# Altium schematic sheet 00 BLOCK DIAGRAM.SchDoc
size A3
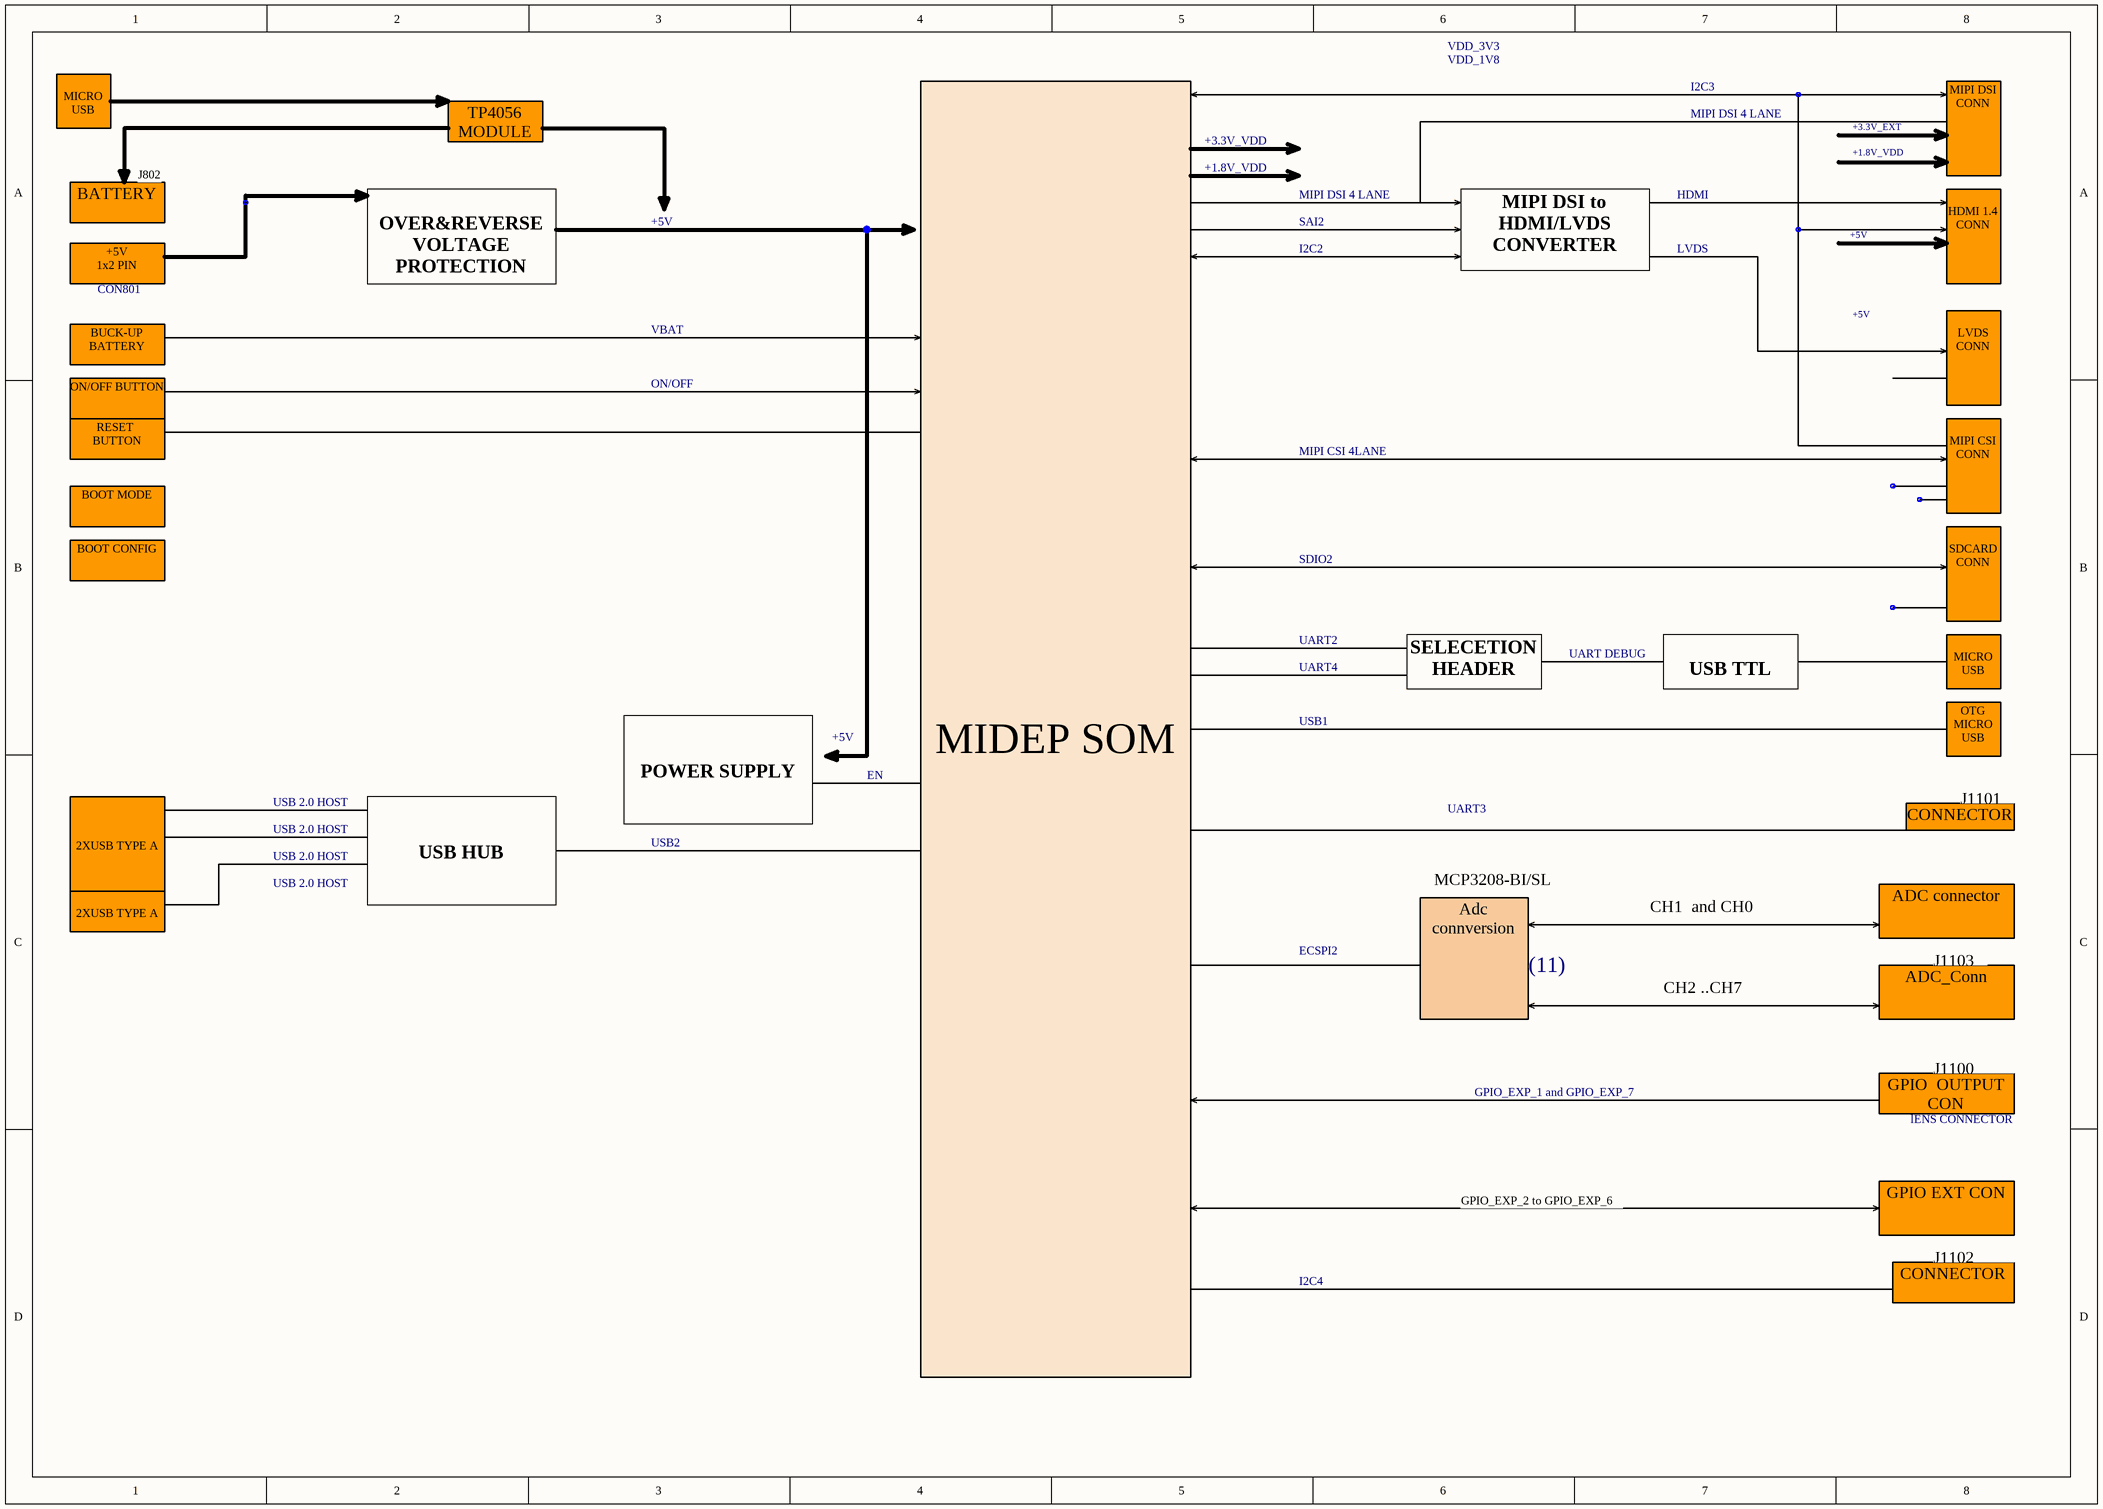
[diagram p0: 00 BLOCK DIAGRAM.SchDoc]

## Notes on the sheet
- VDD_3V3
- VDD_1V8
- I2C3
- MICRO USB
- J802
- TP4056
  MODULE
- +3.3V_VDD
- +1.8V_VDD
- MIPI DSI 4 LANE
- +3.3V_EXT
- MIPI DSI CONN
- BATTERY
- +5V
- SAI2
- HDMI
- +5V
  1x2 PIN
- CON801
- OVER&REVERSE VOLTAGE
  PROTECTION
- I2C2
- MIPI DSI to HDMI/LVDS CONVERTER
- LVDS
- HDMI 1.4 CONN
- BUCK-UP BATTERY
- VBAT
- ON/OFF BUTTON
- ON/OFF
- LVDS CONN
- RESET
  BUTTON
- MIPI CSI 4LANE
- MIPI CSI CONN
- BOOT MODE
- BOOT CONFIG
- SDIO2
- UART2
- SDCARD CONN
- UART4
- SELECETION HEADER
- UART DEBUG
- USB TTL
- EN
- USB1
- OTG
  MICRO USB
- USB 2.0 HOST
- POWER SUPPLY
- USB2
- UART3
- CONNECTOR
- J1101
- 2XUSB TYPE A
- USB HUB
- MCP3208-BI/SL
- CH1  and CH0
- ECSPI2
- (11)
- CH2 ..CH7
- ADC connector
- J1103
- Adc connversion
- ADC_Conn
- GPIO_EXP_1 and GPIO_EXP_7
- GPIO  OUTPUT CON
- lENS CONNECTOR
- J1100
- GPIO_EXP_2 to GPIO_EXP_6
- GPIO EXT CON
- J1102
- I2C4
- MIDEP SOM
- Sheet Title:
- Inventron
- Size:
- Drawn By:
- Revision:
- Project:
- Checked By:
- A4
- Sheet
- of
- Budotek Teknopark
- Dudullu OSB
- Des 2. Cadde No:8/30
- Umraniye / ISTANBUL
- Electronics and Software
- Date:
- Time:
- ©2020 Inventron Electronics and Software. All rights reserved.